# EasyEDA Pro project BLDC大功率驱动器.epro, schematic Schematic1

## Sheets
1 驱动: Board Name: Board1; Create Date: 2026-05-06; Page Name: 驱动; Project Name: FOC驱动器; Schematic Name: Schematic1; Update Date: 2026-05-11; Company: 嘉立创EDA; Page Size: A4; Version: V1.0
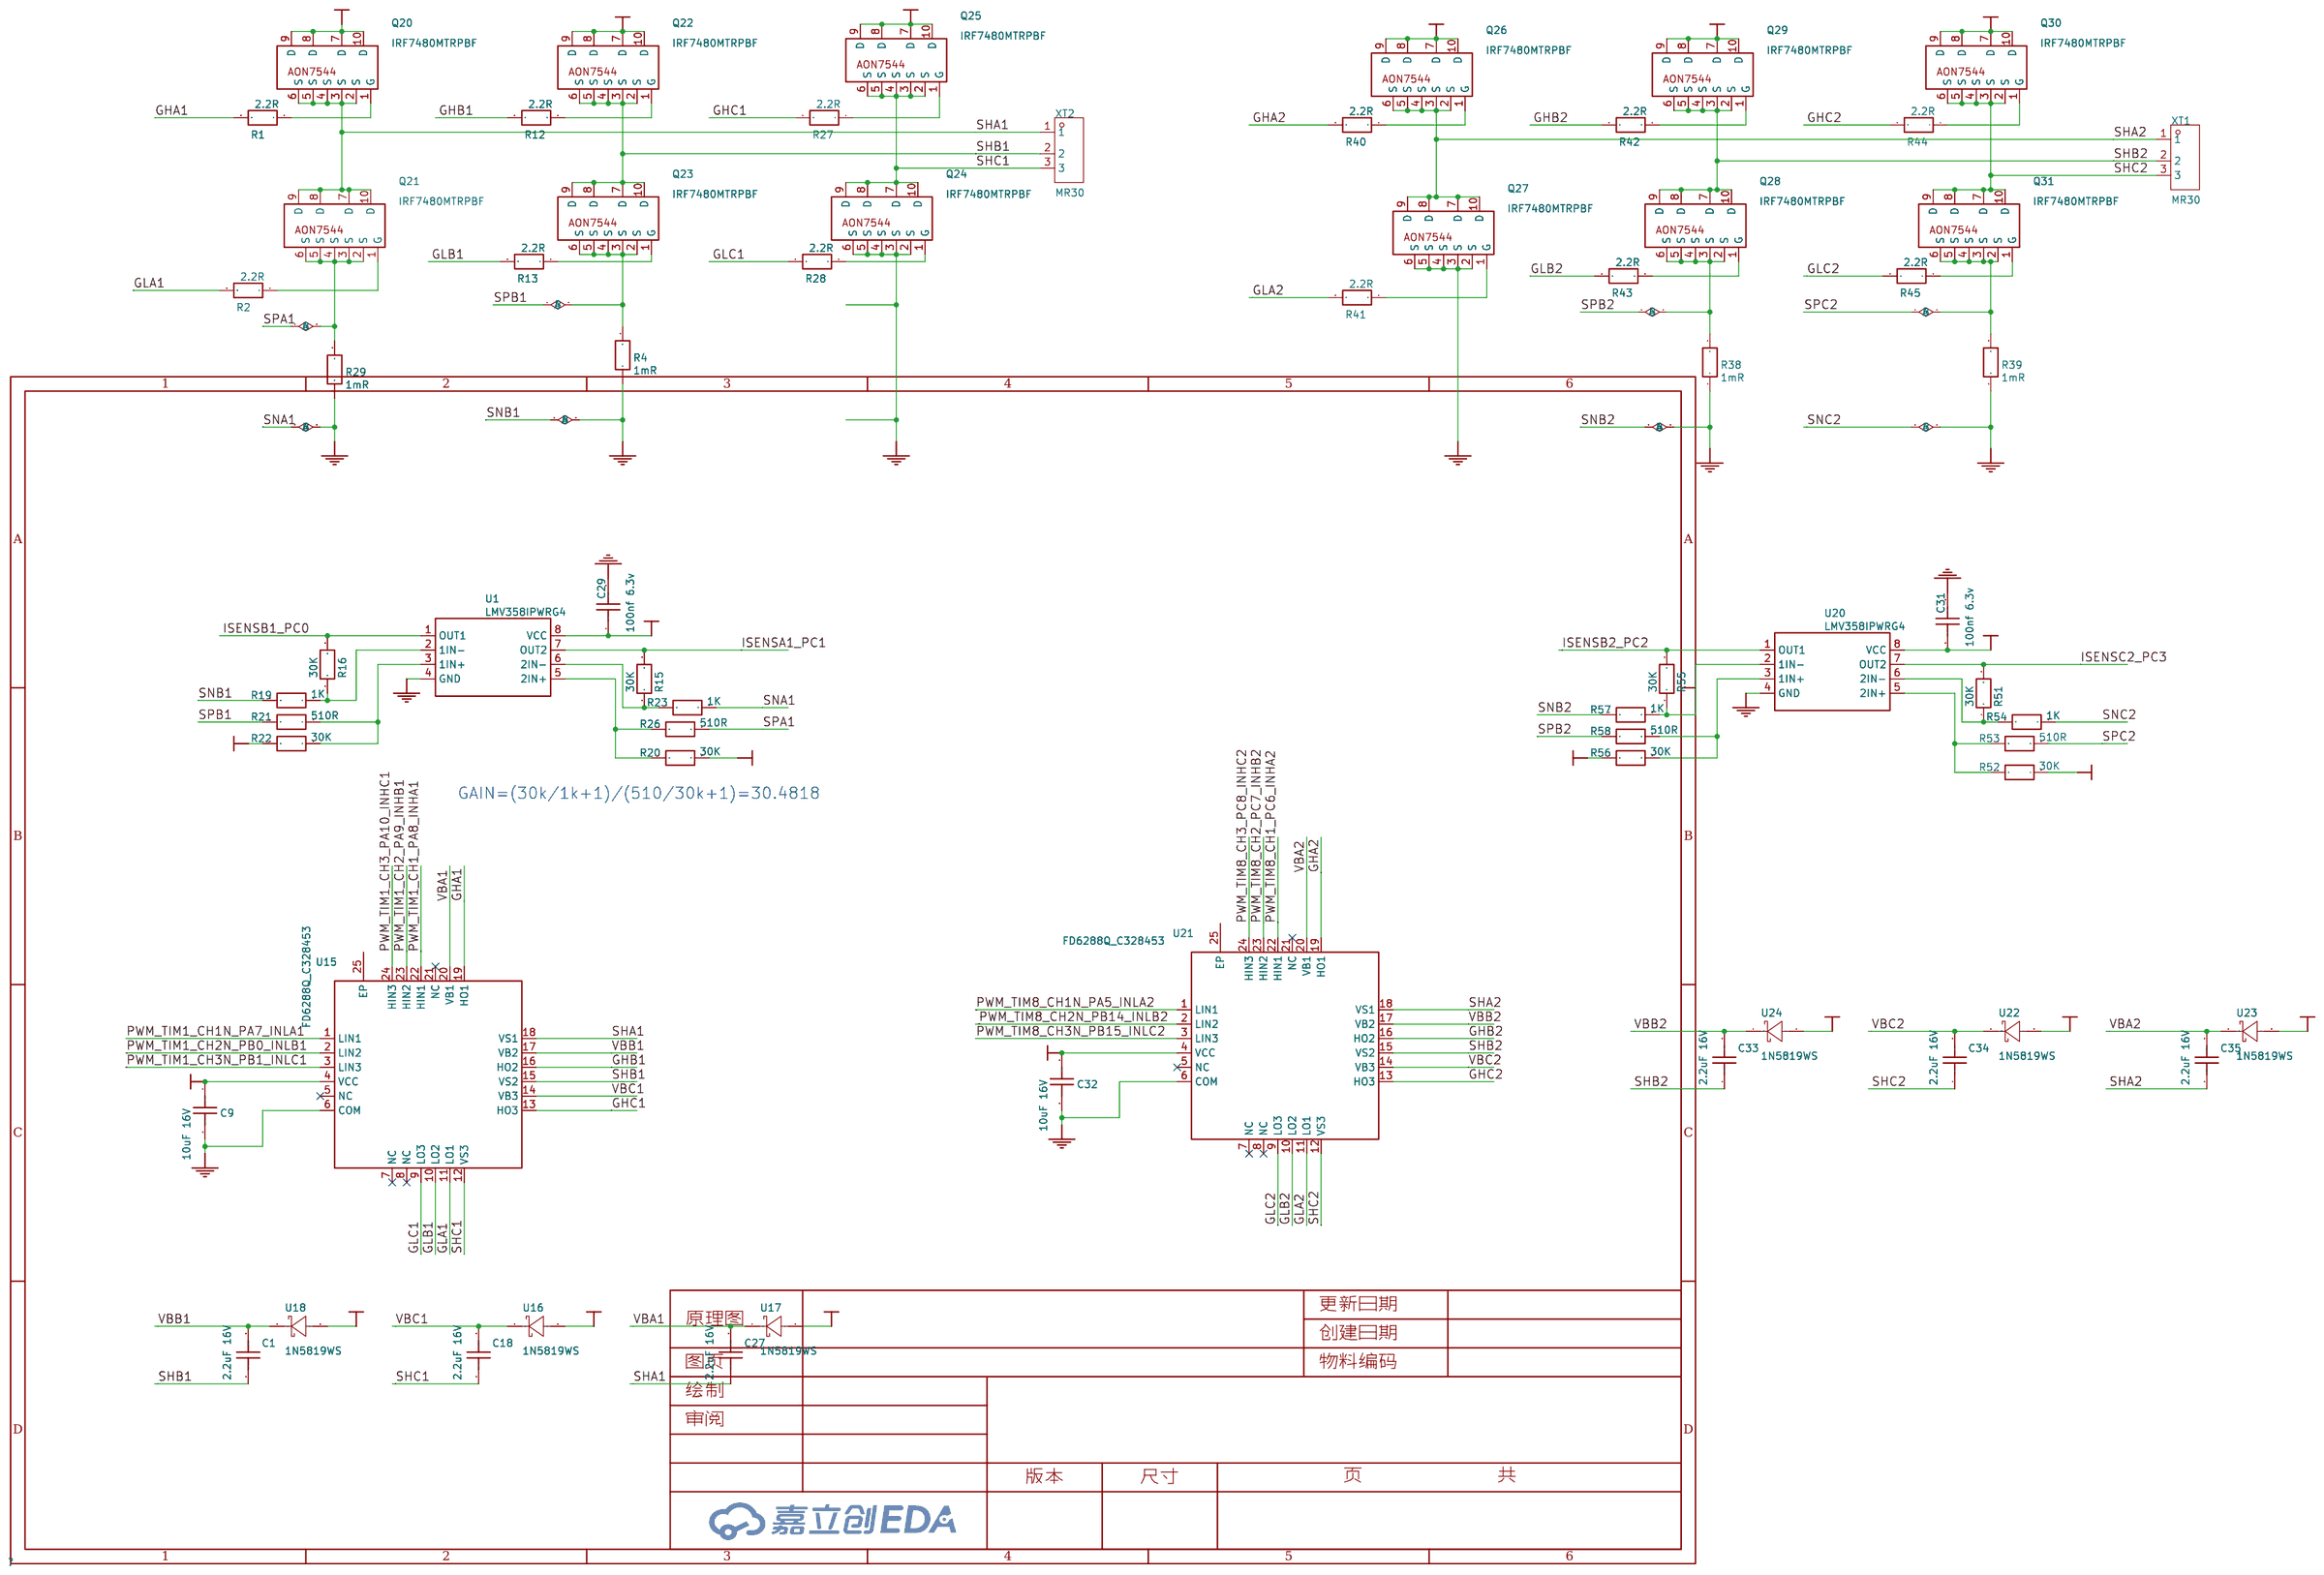
[diagram p0: 驱动]
2 电源: Page Name: 电源; Project Name: FOC驱动器双路; Update Date: 2026-05-10
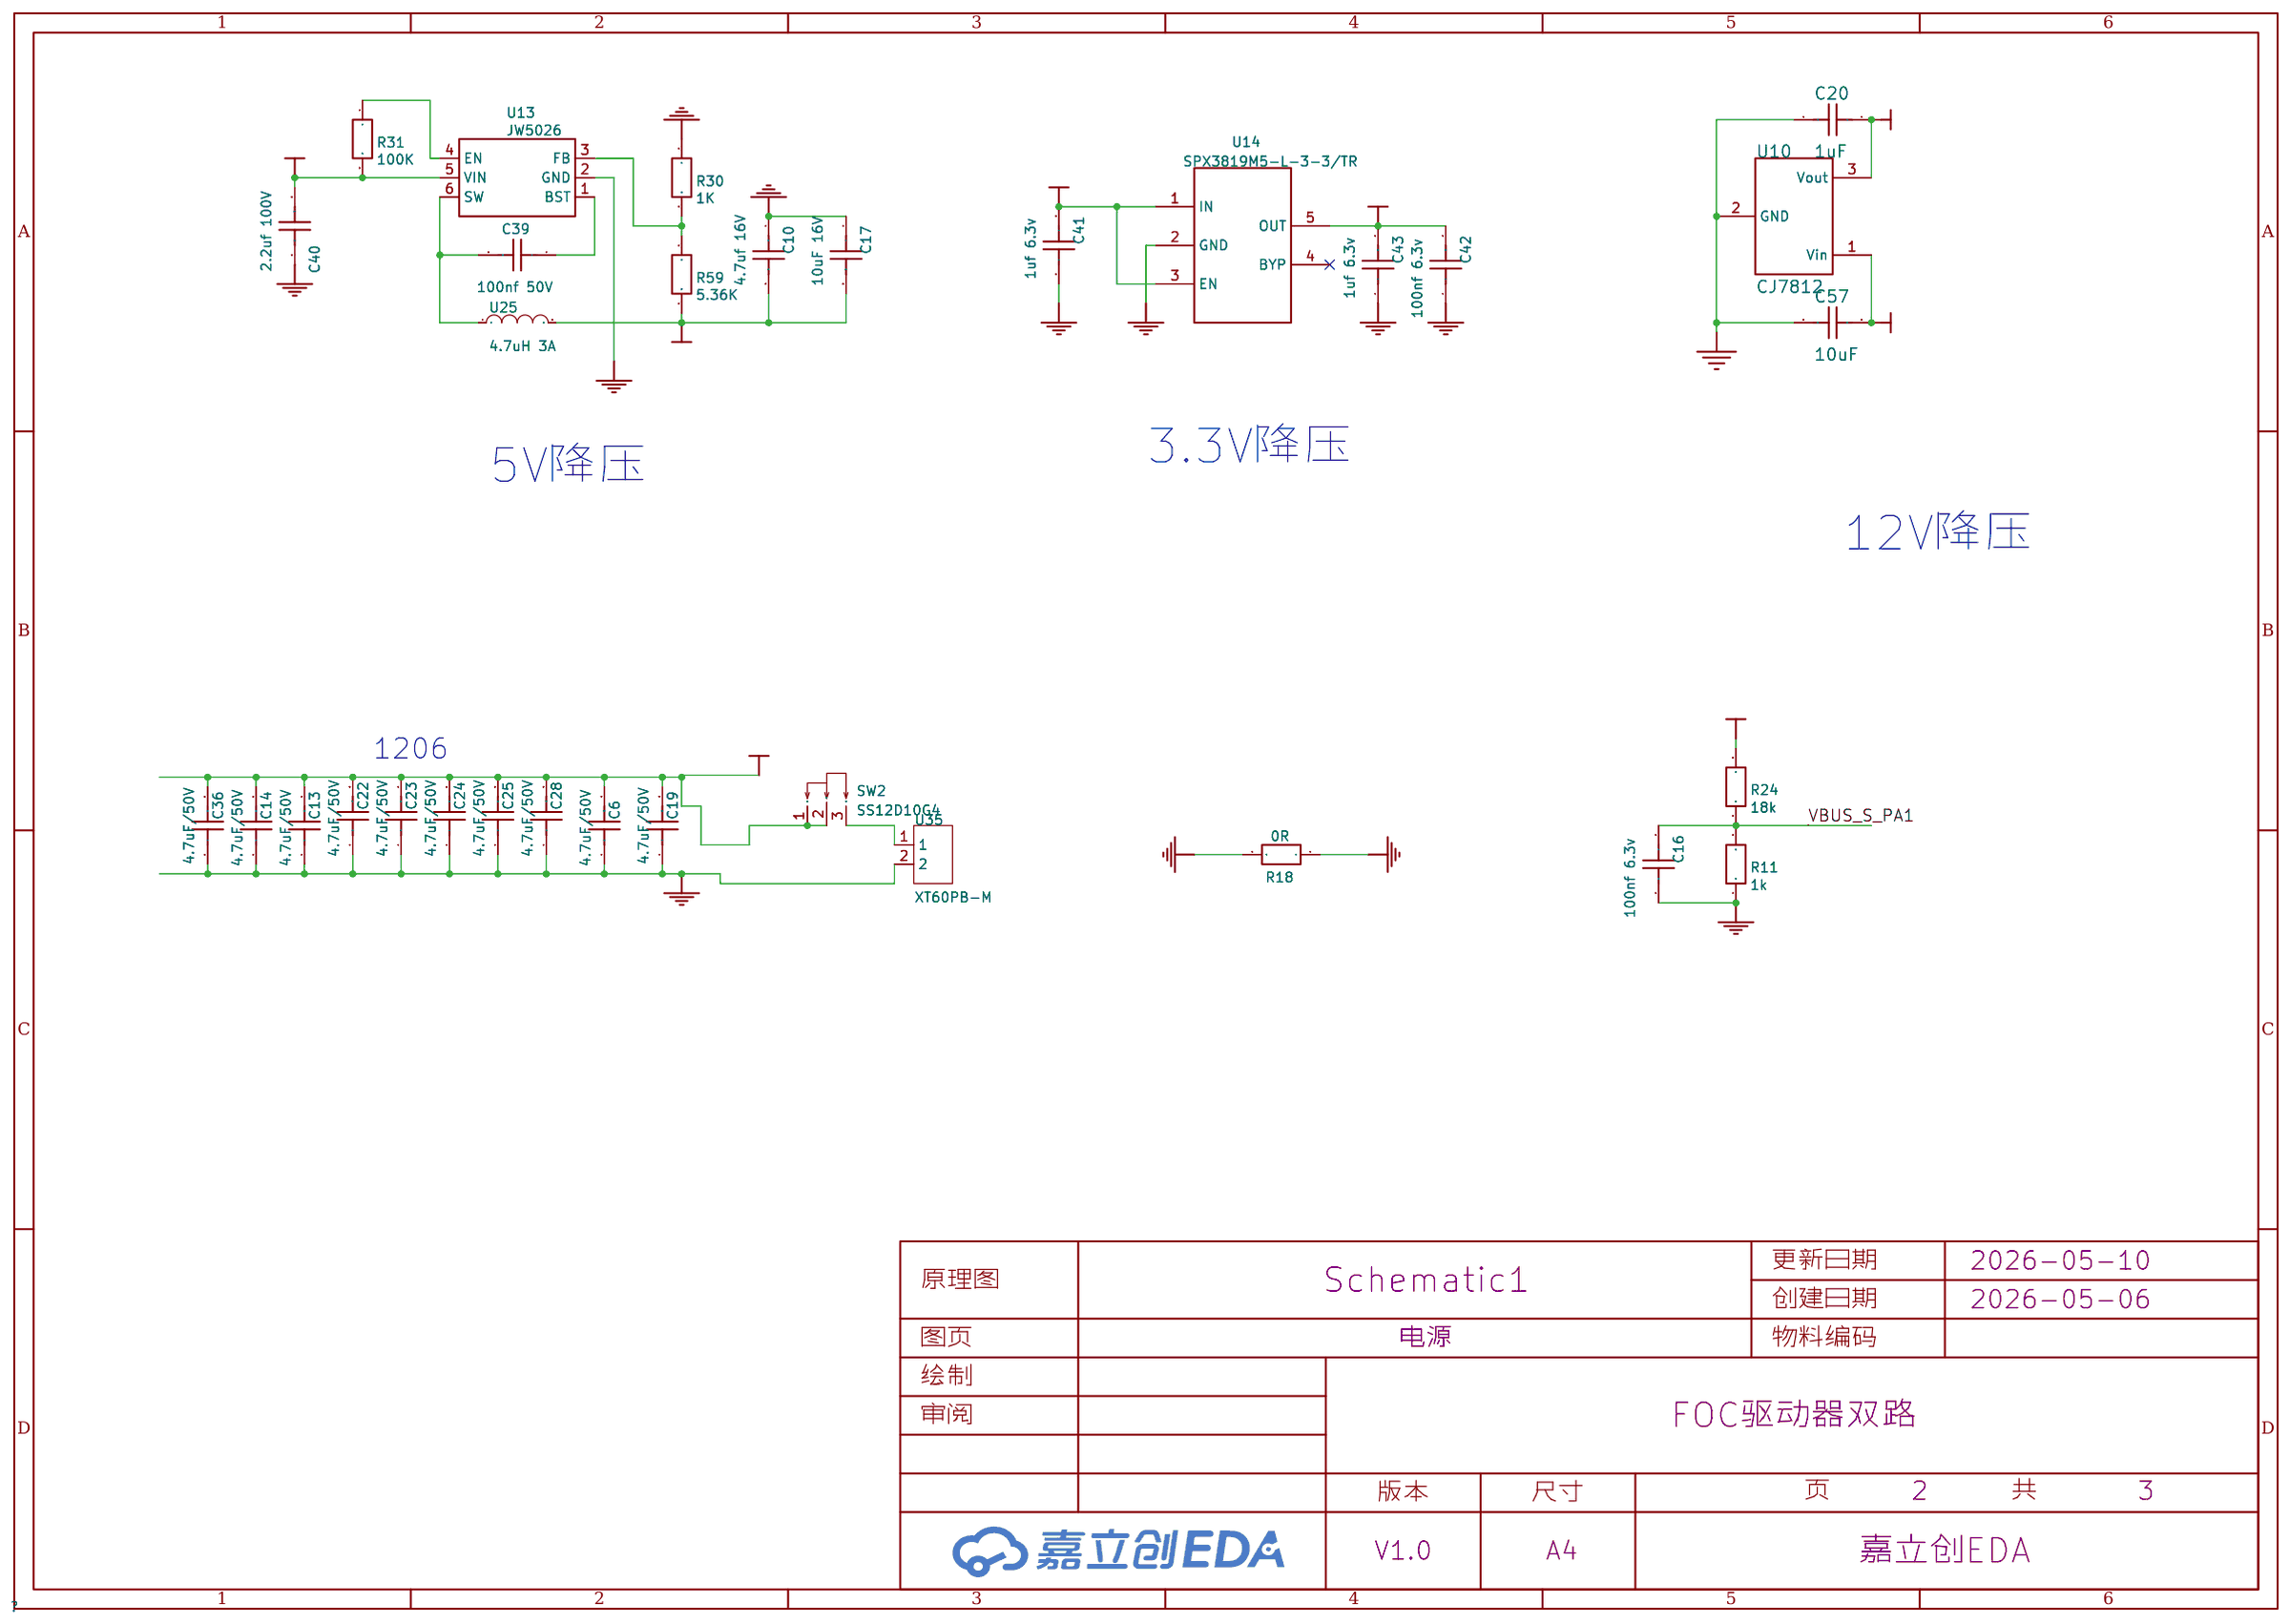
[diagram p1: 电源]
3 主控: Page Name: 主控; Update Date: 2026-05-08
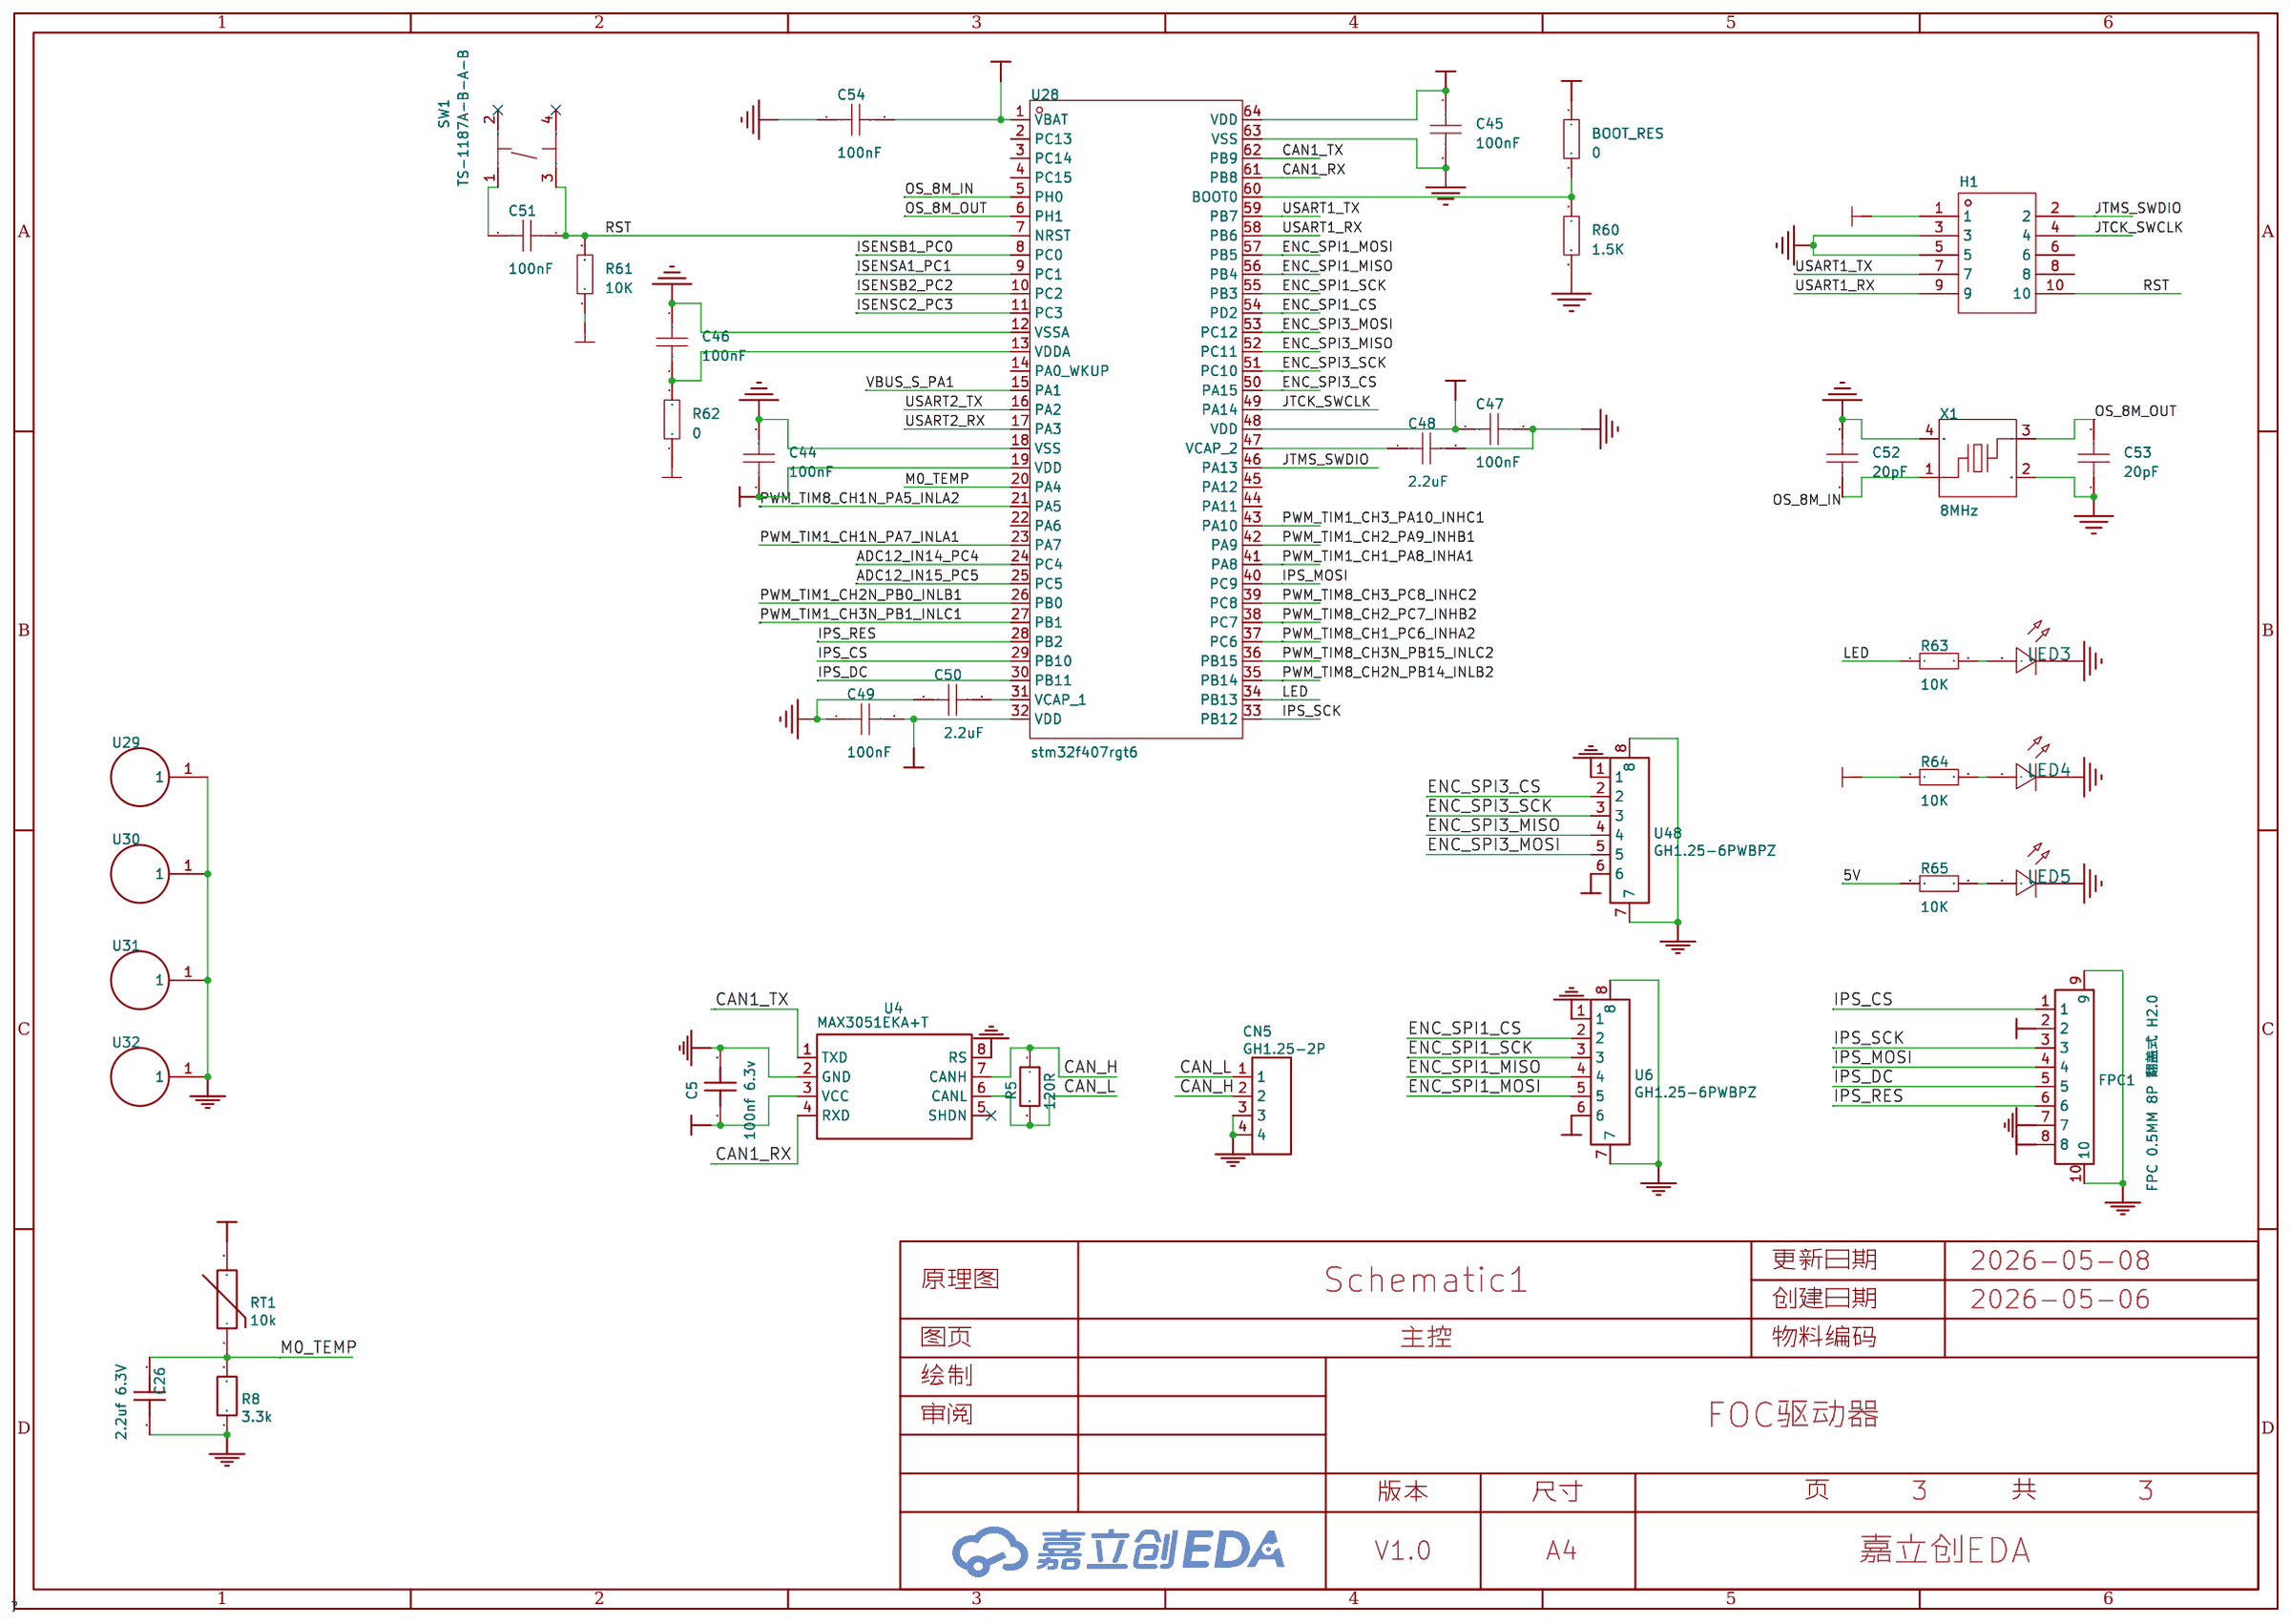
[diagram p2: 主控]

## Parts
sheet 主控
BOOT_RES  0  [R0603]
C5  100nf 6.3v  [C0603]
C26  2.2uf 6.3V  [C0603]
C44  100nF  [C0603]
C45  100nF  [C0603]
C46  100nF  [C0603]
C47  100nF  [C0603]
C48  2.2uF  [C0603]
C49  100nF  [C0603]
C50  2.2uF  [C0603]
C51  100nF  [C0603]
C52  20pF  [C0603]
C53  20pF  [C0603]
C54  100nF  [C0603]
CN5  GH1.25-2P  [CONN-SMD_2P-P1.25_GH1.25-2P]
FPC1  FPC 0.5MM 8P 翻盖式 H2.0  [FPC-SMD_FPC-0.5MM-8P]
H1  -  [HDR-TH_10P-P2.54-V-M-R2-C5-S2.54]
LED3  -  [LED_0603]
LED4  -  [LED_0603]
LED5  -  [LED_0603]
R5  120R  [R0603]
R8  3.3k  [R0603]
R60  1.5K  [R0603]
R61  10K  [R0603]
R62  0  [R0603]
R63  10K  [R0603]
R64  10K  [R0603]
R65  10K  [R0603]
RT1  10k  [R0603]
SW1  TS-1187A-B-A-B  [SW-SMD_4P-L5.1-W5.1-P3.70-LS6.5-TL_H1.5]
U4  MAX3051EKA+T  [SOT-23-8_L3.0-W1.7-P0.65-LS2.8-TL]
U6  GH1.25-6PWBPZ  [CONN-SMD_6P-P1.25_GH1.25-6PWBPZ]
U28  stm32f407rgt6  [LQFP-64_L10.0-W10.0-P0.50-LS12.0-BL]
U29  -  [M3]
U30  -  [M3]
U31  -  [M3]
U32  -  [M3]
U48  GH1.25-6PWBPZ  [CONN-SMD_6P-P1.25_GH1.25-6PWBPZ]
X1  8MHz  [CRYSTAL-SMD_4P-L3.2-W2.5-BL-1]
sheet 电源
C6  4.7uF/50V  [C1206]
C10  4.7uf 16V  [C0603]
C13  4.7uF/50V  [C1206]
C14  4.7uF/50V  [C1206]
C16  100nf 6.3v  [C0603]
C17  10uF 16V  [C0805]
C19  4.7uF/50V  [C1206]
C20  1uF  [C0603]
C22  4.7uF/50V  [C1206]
C23  4.7uF/50V  [C1206]
C24  4.7uF/50V  [C1206]
C25  4.7uF/50V  [C1206]
C28  4.7uF/50V  [C1206]
C36  4.7uF/50V  [C1206]
C39  100nf 50V  [C0603]
C40  2.2uf 100V  [C0805]
C41  1uf 6.3v  [C0603]
C42  100nf 6.3v  [C0603]
C43  1uf 6.3v  [C0603]
C57  10uF  [C0603]
R11  1k  [R0603]
R18  0R  [R0603]
R24  18k  [R0603]
R30  1K  [R0603]
R31  100K  [R0603]
R59  5.36K  [R0603]
SW2  SS12D10G4  [SW-TH_3P-P4.80-HX-SS12D10G4]
U10  CJ7812  [TO-252-3_L6.5-W5.8-P4.58-BL]
U13  JW5026  [SOT-23-6_L2.9-W1.6-P0.95-LS2.8-BR]
U14  SPX3819M5-L-3-3/TR  [SOT-23-5_L3.0-W1.7-P0.95-LS2.8-BR]
U25  4.7uH 3A  [IND-SMD_L7.3-W7.3_GSDRH74P]
U35  XT60PB-M  [CONN-TH_XT60PB-M]
sheet 驱动
C1  2.2uF 16V  [C0603]
C9  10uF 16V  [C0805]
C18  2.2uF 16V  [C0603]
C27  2.2uF 16V  [C0603]
C29  100nf 6.3v  [C0603]
C31  100nf 6.3v  [C0603]
C32  10uF 16V  [C0805]
C33  2.2uF 16V  [C0603]
C34  2.2uF 16V  [C0603]
C35  2.2uF 16V  [C0603]
Q20  IRF7480MTRPBF  [TRS-SMD_IRF7480MTRPBF]
Q21  IRF7480MTRPBF  [TRS-SMD_IRF7480MTRPBF]
Q22  IRF7480MTRPBF  [TRS-SMD_IRF7480MTRPBF]
Q23  IRF7480MTRPBF  [TRS-SMD_IRF7480MTRPBF]
Q24  IRF7480MTRPBF  [TRS-SMD_IRF7480MTRPBF]
Q25  IRF7480MTRPBF  [TRS-SMD_IRF7480MTRPBF]
Q26  IRF7480MTRPBF  [TRS-SMD_IRF7480MTRPBF]
Q27  IRF7480MTRPBF  [TRS-SMD_IRF7480MTRPBF]
Q28  IRF7480MTRPBF  [TRS-SMD_IRF7480MTRPBF]
Q29  IRF7480MTRPBF  [TRS-SMD_IRF7480MTRPBF]
Q30  IRF7480MTRPBF  [TRS-SMD_IRF7480MTRPBF]
Q31  IRF7480MTRPBF  [TRS-SMD_IRF7480MTRPBF]
R1  2.2R  [R0603]
R2  2.2R  [R0603]
R4  1mR  [R1206]
R12  2.2R  [R0603]
R13  2.2R  [R0603]
R15  30K  [R0603]
R16  30K  [R0603]
R19  1K  [R0603]
R20  30K  [R0603]
R21  510R  [R0603]
R22  30K  [R0603]
R23  1K  [R0603]
R26  510R  [R0603]
R27  2.2R  [R0603]
R28  2.2R  [R0603]
R29  1mR  [R1206]
R38  1mR  [R1206]
R39  1mR  [R1206]
R40  2.2R  [R0603]
R41  2.2R  [R0603]
R42  2.2R  [R0603]
R43  2.2R  [R0603]
R44  2.2R  [R0603]
R45  2.2R  [R0603]
R51  30K  [R0603]
R52  30K  [R0603]
R53  510R  [R0603]
R54  1K  [R0603]
R55  30K  [R0603]
R56  30K  [R0603]
R57  1K  [R0603]
R58  510R  [R0603]
U1  LMV358IPWRG4  [TSSOP-8_L4.4-W3.0-P0.65-LS6.4-BL]
U15  FD6288Q_C328453  [QFN-24_L4.0-W4.0-P0.50-BL-EP2.6]
U16  1N5819WS  [SOD-323_L1.7-W1.3-LS2.6-RD]
U17  1N5819WS  [SOD-323_L1.7-W1.3-LS2.6-RD]
U18  1N5819WS  [SOD-323_L1.7-W1.3-LS2.6-RD]
U20  LMV358IPWRG4  [TSSOP-8_L4.4-W3.0-P0.65-LS6.4-BL]
U21  FD6288Q_C328453  [QFN-24_L4.0-W4.0-P0.50-BL-EP2.6]
U22  1N5819WS  [SOD-323_L1.7-W1.3-LS2.6-RD]
U23  1N5819WS  [SOD-323_L1.7-W1.3-LS2.6-RD]
U24  1N5819WS  [SOD-323_L1.7-W1.3-LS2.6-RD]
U38  -  [网络连接]
U39  -  [网络连接]
U40  -  [网络连接]
U41  -  [网络连接]
U44  -  [网络连接]
U45  -  [网络连接]
U46  -  [网络连接]
U47  -  [网络连接]
XT1  MR30  [CONN-TH_MR30PB-M]
XT2  MR30  [CONN-TH_MR30PB-M]

## Library data of the parts
BOOT_RES R60-R65 = Res_0603: Supplier Footprint: 0603
C5 C16 C29 C31 C42 = 100nf 6.3v: nameAlias: Value(F); Contributor: LCEDA_Lib; spicePre: C; spiceSymbolName: C_0603_US
C26 = 2.2uf 6.3V: nameAlias: Value(F); Contributor: LCEDA_Lib; spicePre: C; spiceSymbolName: C_0603_US
C20 C44-C54 C57 = CAP_0603: Supplier Footprint: 0603
CN5 = GH1.25-2P: Supplier: LCSC; Supplier Part: C9900005837; JLCPCB Part Class: Extended Part; Contributor: LCSC; spicePre: C
FPC1 = FPC 0.5MM 8P 翻盖式 H2.0: Supplier: LCSC; Supplier Part: C9347; Manufacturer: ATOM(爱特姆); JLCPCB Part Class: Extended Part; Contributor: LCSC; spicePre: F
H1 = HDR-M_2.54_2x5: Supplier Part: C124387; Supplier Footprint: 插件,P=2.54mm
LED3-LED5 = LED_0603-R: Supplier Footprint: 0603
R5 = 120R: nameAlias: Value(Ω); Contributor: LCEDA_Lib; spicePre: R; spiceSymbolName: R_0603_EU
R8 = 3.3k: nameAlias: Value(Ω); Contributor: LCEDA_Lib; spicePre: R; spiceSymbolName: R_0603_EU
RT1 = 10k: Supplier: LCSC; Supplier Part: C524451; Manufacturer: TDK; Manufacturer Part: NTCG164BH103JT1; Contributor: LCSC; spicePre: R; spiceSymbolName: NTCG164QH474HT1
SW1 = TS-1187A-B-A-B: 电路结构:单刀单掷;按钮形状:圆形按钮;作用力:1.6N;安装方式:立贴;开关长度:5.1mm;开关宽度:5.1mm;开关高度:1.5mm;带支架:不带支架;触点电流:50mA;额定电压:12V;带灯:无;工作寿命:10万次;; LCSC Part Name: 5.1*5.1*1.5mm 立贴 轻触开关; Supplier Part: C318884; Manufacturer: XKB Connection(中国星坤); Supplier Footprint: SMD; JLCPCB Part Class: 基础库; Datasheet: https://item.szlcsc.com/datasheet/TS-1187A-B-A-B/299976.html; Supplier: LCSC; Circuit: 单刀单掷; Actuator Style: 圆形按钮; Operating Force: 1.6N; Mounting Type: 立贴; Length: 5.1mm; Width: 5.1mm; Switch Height: 1.5mm; with Bracket: 不带支架; Contact Current: 50mA; Voltage Rating: 12V; Actuator/Cap Color: 金色; With Lamp: 无; Life: 10万次; Operating Temperature: -30℃~+85℃
U4 = MAX3051EKA+T: Supplier: LCSC; Manufacturer: MAXIM; Supplier Part: C112005; JLCPCB Part Class: Extended Part; LCSC Assembly: Yes; spicePre: U
U6 U48 = GH1.25-6PWBPZ: Supplier: LCSC; Supplier Part: C2829255; Manufacturer: BOOMELE(博穆精密); JLCPCB Part Class: Extended Part; Contributor: LCSC; spicePre: U
U28 = stm32f407rgt6: Supplier Part: C9900095881; Supplier Footprint: LQFP-64; Supplier: LCSC
U29-U32 = M3: M3定位孔
X1 = XL2EL89COI-111YLC-8M: 晶振类型:贴片晶振;频率:8MHz;常温频差:±10ppm;负载电容:12pF;频率稳定度:±20ppm;; LCSC Part Name: YSX321SL 8MHZ 4P 3225 12PF ±10PPM -40~85℃ (±20PPM); Supplier Part: C2973805; Manufacturer: YXC(扬兴晶振); Supplier Footprint: SMD3225-4P; JLCPCB Part Class: 扩展库; Datasheet: https://item.szlcsc.com/datasheet/XL2EL89COI-111YLC-8M/3371202.html; Supplier: LCSC; Type: 贴片晶振; Normal temperature Frequency Tolerance: ±10ppm; Load Capacitance: 12pF; Frequency Stability: ±20ppm; Equivalent Series Resistance(ESR): 150Ω; Operating Temperature: -40℃~+85℃
C6 C13 C14 C19 C22-C25 C28 C36 = 4.7uF/50V: nameAlias: Value(F); Contributor: LCEDA_Lib; spicePre: C; spiceSymbolName: C_1206_US
C10 = 4.7uf 16V: nameAlias: Value(F); Contributor: LCEDA_Lib; spicePre: C; spiceSymbolName: C_0603_US
C17 = 10uF 16V: nameAlias: Value(F); Contributor: LCEDA_Lib; spicePre: C; spiceSymbolName: C_0603_US
C39 = 100nf 50V: nameAlias: Value(F); Contributor: LCEDA_Lib; spicePre: C; spiceSymbolName: C_0603_US
C40 = 2.2uf 100V: nameAlias: Value(F); Contributor: LCEDA_Lib; spicePre: C; spiceSymbolName: C_0805_US
C41 C43 = 1uf 6.3v: nameAlias: Value(F); Contributor: LCEDA_Lib; spicePre: C; spiceSymbolName: C_0603_US
R11 = 1k: nameAlias: Value(Ω); Contributor: LCEDA_Lib; spicePre: R; spiceSymbolName: R_0603_EU
R18 = 0R: nameAlias: Value(Ω); Contributor: LCEDA_Lib; spicePre: R; spiceSymbolName: R_0603_EU
R24 = 18k: nameAlias: Value(Ω); Contributor: LCEDA_Lib; spicePre: R; spiceSymbolName: R_0603_EU
R19 R23 R30 R54 R57 = 1K: nameAlias: Value(Ω); Contributor: LCEDA_Lib; spicePre: R; spiceSymbolName: R_0603_EU
R31 = 100K: nameAlias: Value(Ω); Contributor: LCEDA_Lib; spicePre: R; spiceSymbolName: R_0603_EU
R59 = 5.36K: nameAlias: Value(Ω); Contributor: LCEDA_Lib; spicePre: R; spiceSymbolName: R_0603_EU
SW2 = SS12D10G4: Supplier Part: C48601060; Manufacturer: HanElectricity(瀚源); Supplier Footprint: 插件; JLCPCB Part Class: 扩展库; Datasheet: https://atta.szlcsc.com/upload/public/pdf/source/20250425/7306465D89C7B2768FA76DB598AA58D4.pdf; Supplier: LCSC
U10 = CJ7812_C26184: LCSC Part Name: 输入35V 输出12V 1.5A; Supplier Part: C26184; Manufacturer: CJ(江苏长电/长晶); Supplier Footprint: TO-252-2; JLCPCB Part Class: 扩展库; Datasheet: https://atta.szlcsc.com/upload/public/pdf/source/20180412/C26184_C7F45D4504ECDF2F14935BA96F015906.pdf; Supplier: LCSC; Output Type: 固定; Maximum Input Voltage: 35V; Output Voltage: 12V; Output Current: 1.5A; Dropout Voltage: 2V@(1A); Output Polarity: 正极; Number of Outputs: 1
U13 = JW5026: Supplier: LCSC; Supplier Part: C185109; Manufacturer: JoulWatt Tech; JLCPCB Part Class: Extended Part; Contributor: LCSC; spicePre: U
U14 = SPX3819M5-L-3-3/TR: Supplier: LCSC; Manufacturer: EXAR; Supplier Part: C9055; JLCPCB Part Class: Extended Part; spicePre: U
U25 = 4.7uH 3A: Supplier Part: C9900003590; Supplier Footprint: 4.7uH2A; JLCPCB Part Class: 扩展库; Supplier: LCSC
U35 = XT60PB-M: Supplier Part: C9900017179; Supplier Footprint: Throughhole; JLCPCB Part Class: 扩展库; Supplier: LCSC
C1 C18 C27 C33-C35 = 2.2uF 16V: nameAlias: Value(F); Contributor: LCEDA_Lib; spicePre: C; spiceSymbolName: C_0603_US
C9 C32 = 10uF 16V: nameAlias: Value(F); Contributor: LCEDA_Lib; spicePre: C; spiceSymbolName: C_0805_US
Q20-Q31 = IRF7480MTRPBF: 数量:1个N沟道;漏源电压(Vdss):40V;连续漏极电流(Id):330A;导通电阻(RDS(on)):1.6mΩ@6V,66A;耗散功率(Pd):96W;阈值电压(Vgs(th)):3.9V@150uA;; LCSC Part Name: 1个N沟道 耐压:40V 电流:330A; Supplier Part: C152356; Manufacturer: Infineon(英飞凌); Supplier Footprint: DirectFET; JLCPCB Part Class: 扩展库; Datasheet: https://item.szlcsc.com/datasheet/IRF7480MTRPBF/163696.html; Supplier: LCSC; Number: 1个N沟道; Drain to Source Voltage: 40V; Current - Continuous Drain(Id): 330A; RDS(on): 1.6mΩ@6V,66A; Pd - Power Dissipation: 96W; Gate Threshold Voltage (Vgs(th)): 3.9V@150uA; Gate Charge(Qg): 123nC@10V; Operating Temperature: -55℃~+150℃; Type: N沟道; Output Capacitance(Coss): 1.035nF
R1 R2 R12 R13 R27 R28 R40-R45 = 2.2R: nameAlias: Value(Ω); Contributor: LCEDA_Lib; spicePre: R; spiceSymbolName: R_0603_EU
R4 R29 R38 R39 = 1mR: nameAlias: Value(Ω); Contributor: LCEDA_Lib; spicePre: R; spiceSymbolName: R_1206_EU
R15 R16 R20 R22 R51 R52 R55 R56 = 30K: nameAlias: Value(Ω); Contributor: LCEDA_Lib; spicePre: R; spiceSymbolName: R_0603_EU
R21 R26 R53 R58 = 510R: nameAlias: Value(Ω); Contributor: LCEDA_Lib; spicePre: R; spiceSymbolName: R_0603_EU
U1 U20 = LMV358IPWRG4: Supplier: LCSC; Manufacturer: TI; Supplier Part: C7981; JLCPCB Part Class: Extended Part; spicePre: U
U15 U21 = FD6288Q_C328453: Supplier: LCSC; Supplier Part: C328453; Manufacturer: Fortior Tech; Manufacturer Part: FD6288Q; JLCPCB Part Class: Extended Part; Contributor: LCSC; spicePre: U
U16-U18 U22-U24 = 1N5819WS_C7202959: 正向压降(Vf):600mV@1A;直流反向耐压(Vr):40V;整流电流:1A;; Supplier Part: C7202959; Manufacturer: TECH PUBLIC(台舟); Supplier Footprint: SOD-323; JLCPCB Part Class: 扩展库; Datasheet: https://item.szlcsc.com/datasheet/1N5819WS/8170917.html; Supplier: LCSC; Voltage - Forward(Vf@If): 600mV@1A; Voltage - DC Reverse(Vr): 40V; Current - Rectified: 1A; Reverse Leakage Current (Ir): 1mA@40V; Non-Repetitive Peak Forward Surge Current: 10A
U38-U41 U44-U47 = 网络链接: 不同网络明间连接
XT1 XT2 = MR30: Supplier Part: C9900021020; Supplier Footprint: MR30PB-M; JLCPCB Part Class: 扩展库; Supplier: LCSC

## Nets
5V: C10.2 C17.2 C41.2 R59.2 R65.1 U14.1(IN) U14.3(EN) U25.2
12V: C9.1 C20.1 C32.1 U10.3(Vout) U15.4(VCC) U16.2(A) U17.2(A) U18.2(A) U21.4(VCC) U22.2(A) U23.2(A) U24.2(A)
DGND: C5.2 C9.2 C10.1 C16.1 C17.1 C20.2 C26.2 C29.2 C31.2 C32.2 C40.1 C41.1 C42.1 C43.1 C44.2 C45.2 C46.2 C47.2 C48.2 C49.1 C50.1 C52.2 C53.1 C54.1 C57.2 CN5.3 CN5.4 FPC1.7 FPC1.9 FPC1.10 H1.3 H1.5 LED3.1(C) LED4.1(C) LED5.1(C) R8.1 R11.1 R18.2 R30.1 R60.2 U1.4(GND) U4.2(GND) U4.8(RS) U6.1 U6.7 U6.8 U10.2(GND) U13.2(GND) U14.2(GND) U15.6(COM) U20.4(GND) U21.6(COM) U28.12(VSSA) U28.18(VSS) U28.63(VSS) U29.1 U30.1 U31.1 U32.1 U48.1 U48.7 U48.8 X1.2(GND) X1.4(GND)
PGND: C6.1 C13.1 C14.1 C19.1 C22.1 C23.1 C24.1 C25.1 C28.1 C36.1 Q24.2(S) Q24.3(S) Q24.4(S) Q24.5(S) Q24.6(S) Q27.2(S) Q27.3(S) Q27.4(S) Q27.5(S) Q27.6(S) R4.1 R18.1 R29.1 R38.1 R39.1 U35.2 U38.2(B) U41.2(B) U44.2(B) U47.2(B)
VBUS_S_PA1: C16.2 R11.2 R24.1 U28.15(PA1)
VCC: BOOT_RES.1 C5.1 C29.1 C31.1 C42.2 C43.2 C44.1 C45.1 C47.1 C49.2 C54.2 FPC1.2 FPC1.8 H1.1 R20.1 R22.2 R52.1 R56.2 R61.1 R62.1 R64.1 RT1.2 U1.8(VCC) U4.3(VCC) U6.6 U14.5(OUT) U20.8(VCC) U28.1(VBAT) U28.19(VDD) U28.32(VDD) U28.48(VDD) U28.64(VDD) U48.6
ADC12_IN14_PC4: U28.24(PC4)
ADC12_IN15_PC5: U28.25(PC5)
CAN1_RX: U4.4(RXD) U28.61(PB8)
CAN1_TX: U4.1(TXD) U28.62(PB9)
CAN_H: CN5.2 R5.1 U4.7(CANH)
CAN_L: CN5.1 R5.2 U4.6(CANL)
DCBUS: C6.2 C13.2 C14.2 C19.2 C22.2 C23.2 C24.2 C25.2 C28.2 C36.2 C40.2 C57.1 Q20.7(D) Q20.8(D) Q20.9(D) Q20.10(D) Q22.7(D) Q22.8(D) Q22.9(D) Q22.10(D) Q25.7(D) Q25.8(D) Q25.9(D) Q25.10(D) Q26.7(D) Q26.8(D) Q26.9(D) Q26.10(D) Q29.7(D) Q29.8(D) Q29.9(D) Q29.10(D) Q30.7(D) Q30.8(D) Q30.9(D) Q30.10(D) R24.2 R31.2 SW2.1 SW2.2 U10.1(Vin) U13.5(VIN)
ENC_SPI1_CS: U6.2 U28.54(PD2)
ENC_SPI1_MISO: U6.4 U28.56(PB4)
ENC_SPI1_MOSI: U6.5 U28.57(PB5)
ENC_SPI1_SCK: U6.3 U28.55(PB3)
ENC_SPI3_CS: U28.50(PA15) U48.2
ENC_SPI3_MISO: U28.52(PC11) U48.4
ENC_SPI3_MOSI: U28.53(PC12) U48.5
ENC_SPI3_SCK: U28.51(PC10) U48.3
GHA1: R1.2 U15.19(HO1)
GHA2: R40.2 U21.19(HO1)
GHB1: R12.2 U15.16(HO2)
GHB2: R42.2 U21.16(HO2)
GHC1: R27.2 U15.13(HO3)
GHC2: R44.2 U21.13(HO3)
GLA1: R2.2 U15.11(LO1)
GLA2: R41.2 U21.11(LO1)
GLB1: R13.2 U15.10(LO2)
GLB2: R43.2 U21.10(LO2)
GLC1: R28.2 U15.9(LO3)
GLC2: R45.2 U21.9(LO3)
IPS_CS: FPC1.1 U28.29(PB10)
IPS_DC: FPC1.5 U28.30(PB11)
IPS_MOSI: FPC1.4 U28.40(PC9)
IPS_RES: FPC1.6 U28.28(PB2)
IPS_SCK: FPC1.3 U28.33(PB12)
ISENSA1_PC1: R15.2 U1.7(OUT2) U28.9(PC1)
ISENSB1_PC0: R16.2 U1.1(OUT1) U28.8(PC0)
ISENSB2_PC2: R55.2 U20.1(OUT1) U28.10(PC2)
ISENSC2_PC3: R51.2 U20.7(OUT2) U28.11(PC3)
JTCK_SWCLK: H1.4 U28.49(PA14)
JTMS_SWDIO: H1.2 U28.46(PA13)
LED: R63.1 U28.34(PB13)
M0_TEMP: C26.1 R8.2 RT1.1 U28.20(PA4)
OS_8M_IN: C52.1 U28.5(PH0) X1.1
OS_8M_OUT: C53.2 U28.6(PH1) X1.3
PWM_TIM1_CH1_PA8_INHA1: U15.22(HIN1) U28.41(PA8)
PWM_TIM1_CH1N_PA7_INLA1: U15.1(LIN1) U28.23(PA7)
PWM_TIM1_CH2_PA9_INHB1: U15.23(HIN2) U28.42(PA9)
PWM_TIM1_CH2N_PB0_INLB1: U15.2(LIN2) U28.26(PB0)
PWM_TIM1_CH3_PA10_INHC1: U15.24(HIN3) U28.43(PA10)
PWM_TIM1_CH3N_PB1_INLC1: U15.3(LIN3) U28.27(PB1)
PWM_TIM8_CH1_PC6_INHA2: U21.22(HIN1) U28.37(PC6)
PWM_TIM8_CH1N_PA5_INLA2: U21.1(LIN1) U28.21(PA5)
PWM_TIM8_CH2_PC7_INHB2: U21.23(HIN2) U28.38(PC7)
PWM_TIM8_CH2N_PB14_INLB2: U21.2(LIN2) U28.35(PB14)
PWM_TIM8_CH3_PC8_INHC2: U21.24(HIN3) U28.39(PC8)
PWM_TIM8_CH3N_PB15_INLC2: U21.3(LIN3) U28.36(PB15)
RST: C51.1 H1.10 R61.2 SW1.3(C) U28.7(NRST)
SHA1: C27.1 Q20.2(S) Q20.3(S) Q20.4(S) Q20.5(S) Q20.6(S) Q21.7(D) Q21.8(D) Q21.9(D) Q21.10(D) U15.18(VS1) XT2.1
SHA2: C35.1 Q26.2(S) Q26.3(S) Q26.4(S) Q26.5(S) Q26.6(S) Q27.7(D) Q27.8(D) Q27.9(D) Q27.10(D) U21.18(VS1) XT1.1
SHB1: C1.1 Q22.2(S) Q22.3(S) Q22.4(S) Q22.5(S) Q22.6(S) Q23.7(D) Q23.8(D) Q23.9(D) Q23.10(D) U15.15(VS2) XT2.2
SHB2: C33.1 Q28.7(D) Q28.8(D) Q28.9(D) Q28.10(D) Q29.2(S) Q29.3(S) Q29.4(S) Q29.5(S) Q29.6(S) U21.15(VS2) XT1.2
SHC1: C18.1 Q24.7(D) Q24.8(D) Q24.9(D) Q24.10(D) Q25.2(S) Q25.3(S) Q25.4(S) Q25.5(S) Q25.6(S) U15.12(VS3) XT2.3
SHC2: C34.1 Q30.2(S) Q30.3(S) Q30.4(S) Q30.5(S) Q30.6(S) Q31.7(D) Q31.8(D) Q31.9(D) Q31.10(D) U21.12(VS3) XT1.3
SNA1: R23.1 U47.1(A)
SNB1: R19.2 U44.1(A)
SNB2: R57.2 U38.1(A)
SNC2: R54.1 U41.1(A)
SPA1: R26.1 U46.1(A)
SPB1: R21.2 U45.1(A)
SPB2: R58.2 U39.1(A)
SPC2: R53.1 U40.1(A)
USART1_RX: H1.9 U28.58(PB6)
USART1_TX: H1.7 U28.59(PB7)
USART2_RX: U28.17(PA3)
USART2_TX: U28.16(PA2)
VBA1: C27.2 U15.20(VB1) U17.1(C)
VBA2: C35.2 U21.20(VB1) U23.1(C)
VBB1: C1.2 U15.17(VB2) U18.1(C)
VBB2: C33.2 U21.17(VB2) U24.1(C)
VBC1: C18.2 U15.14(VB3) U16.1(C)
VBC2: C34.2 U21.14(VB3) U22.1(C)
$1N1196: Q23.2(S) Q23.3(S) Q23.4(S) Q23.5(S) Q23.6(S) R4.2 U45.2(B)
$1N1202: Q21.1(G) R2.1
$1N1207: Q23.1(G) R13.1
$1N1208: Q22.1(G) R12.1
$1N1213: Q25.1(G) R27.1
$1N1222: Q24.1(G) R28.1
$1N1227: Q21.2(S) Q21.3(S) Q21.4(S) Q21.5(S) Q21.6(S) R29.2 U46.2(B)
$1N1611: R16.1 R19.1 U1.2(1IN-)
$1N1616: R21.1 R22.1 U1.3(1IN+)
$1N1624: R15.1 R23.2 U1.6(2IN-)
$1N1625: R20.2 R26.2 U1.5(2IN+)
$1N3933: Q26.1(G) R40.1
$1N3934: Q27.1(G) R41.1
$1N3940: Q28.1(G) R43.1
$1N3941: Q29.1(G) R42.1
$1N3946: Q30.1(G) R44.1
$1N3955: Q31.1(G) R45.1
$1N4496: R55.1 R57.1 U20.2(1IN-)
$1N4501: R56.1 R58.1 U20.3(1IN+)
$1N4509: R51.1 R54.2 U20.6(2IN-)
$1N4510: R52.2 R53.2 U20.5(2IN+)
$1N6360: Q20.1(G) R1.1
$1N6885: Q31.2(S) Q31.3(S) Q31.4(S) Q31.5(S) Q31.6(S) R39.2 U40.2(B)
$1N8266: Q28.2(S) Q28.3(S) Q28.4(S) Q28.5(S) Q28.6(S) R38.2 U39.2(B)
$2N407: R30.2 R59.1 U13.3(FB)
$2N408: C39.1 U13.1(BST)
$2N409: C39.2 U13.6(SW) U25.1
$2N410: R31.1 U13.4(EN)
$2N2951: SW2.3 U35.1
$3N2156: C46.1 R62.2 U28.13(VDDA)
$3N2326: C48.1 U28.47(VCAP_2)
$3N2403: C50.2 U28.31(VCAP_1)
$3N2502: BOOT_RES.2 R60.1 U28.60(BOOT0)
$3N3085: C51.2 SW1.1(A)
$3N3763: LED3.2(A) R63.2
$3N3864: LED4.2(A) R64.2
$3N3935: LED5.2(A) R65.2

Not connected (* = marked no-connect by the designer): H1 6 8; SW1 2(B)* 4(D)*; U4 5(SHDN)*; U14 4(BYP)*; U15 5(NC)* 7(NC)* 8(NC)* 21(NC)* 25(EP); U21 5(NC)* 7(NC)* 8(NC)* 21(NC)* 25(EP); U28 2(PC13) 3(PC14) 4(PC15) 14(PA0_WKUP) 22(PA6) 44(PA11) 45(PA12)

## Notes on the sheets
sheet 1
- GAIN=(30k/1k+1)/(510/30k+1)=30.4818
sheet 2
- 3.3V降压
- 5V降压
- 12V降压
- 1206
